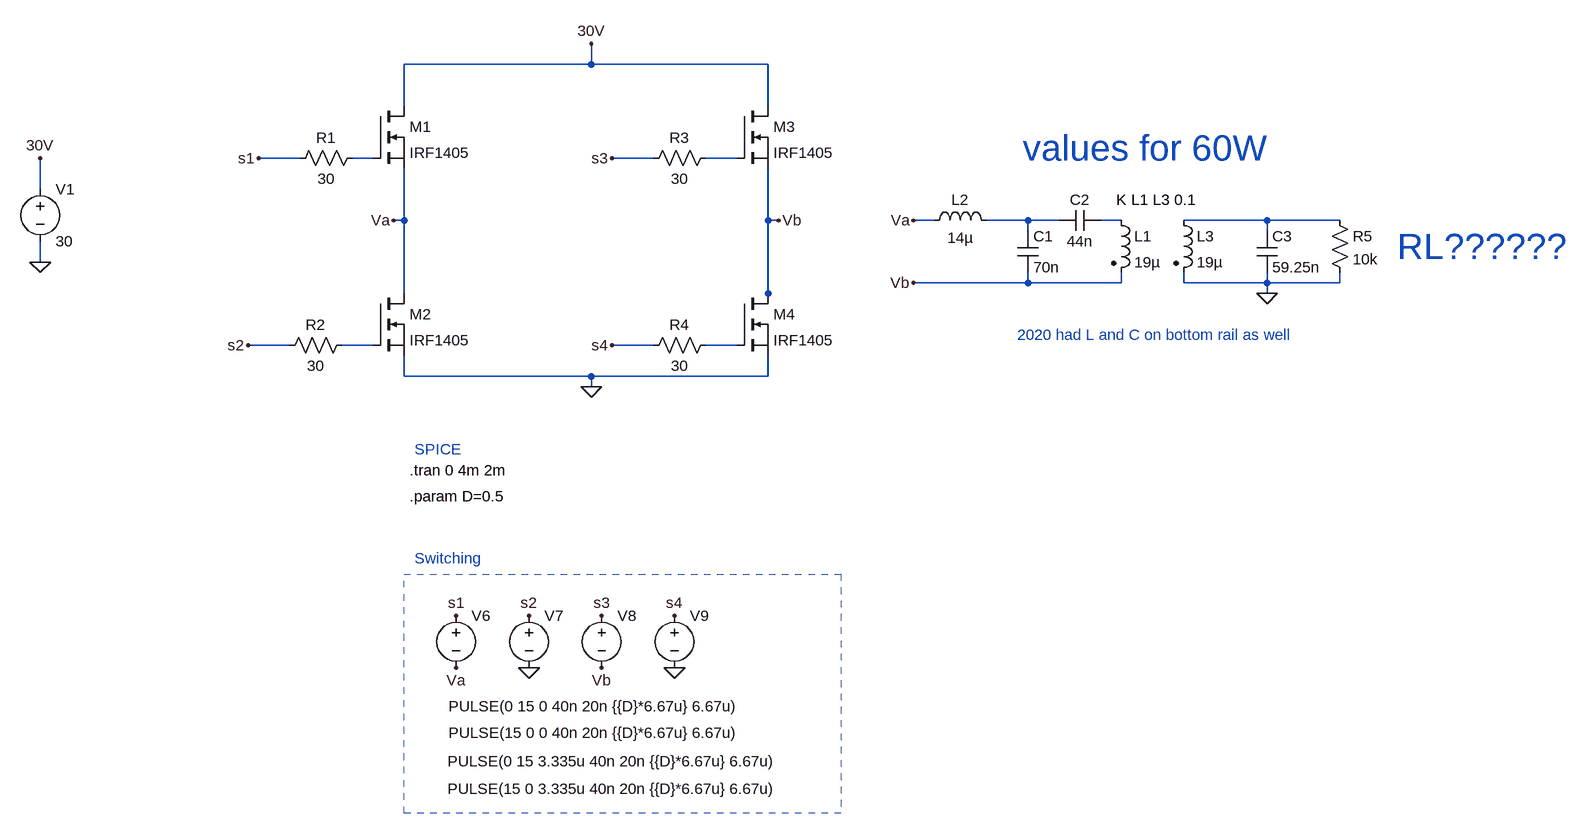
[diagram p0: schematic primary_system.asc]
primary_system.asc, the LTspice schematic file:
Version 4
SHEET 1 2000 1092
WIRE 352 -64 352 -96
WIRE 352 -64 64 -64
WIRE 624 -64 352 -64
WIRE 64 0 64 -64
WIRE 624 0 624 -64
WIRE -96 80 -160 80
WIRE 16 80 -16 80
WIRE 448 80 384 80
WIRE 576 80 528 80
WIRE -496 128 -496 80
WIRE 64 176 64 96
WIRE 64 176 48 176
WIRE 624 176 624 96
WIRE 640 176 624 176
WIRE 880 176 848 176
WIRE 1024 176 960 176
WIRE 1072 176 1024 176
WIRE 1168 176 1136 176
WIRE 1392 176 1264 176
WIRE 1504 176 1392 176
WIRE 1024 192 1024 176
WIRE 1392 192 1392 176
WIRE -496 240 -496 208
WIRE 1024 272 1024 256
WIRE 1024 272 848 272
WIRE 1168 272 1168 256
WIRE 1168 272 1024 272
WIRE 1264 272 1264 256
WIRE 1392 272 1392 256
WIRE 1392 272 1264 272
WIRE 1504 272 1504 256
WIRE 1504 272 1392 272
WIRE 64 288 64 176
WIRE 624 288 624 176
WIRE 1392 288 1392 272
WIRE 624 304 624 288
WIRE -112 368 -176 368
WIRE 16 368 -32 368
WIRE 448 368 384 368
WIRE 576 368 528 368
WIRE 64 416 64 384
WIRE 352 416 64 416
WIRE 624 416 624 384
WIRE 624 416 352 416
WIRE 352 432 352 416
FLAG 48 176 Va
FLAG 640 176 Vb
FLAG 144 864 Va
FLAG 368 864 Vb
FLAG 256 864 0
FLAG 480 864 0
FLAG 144 784 s1
FLAG 256 784 s2
FLAG 368 784 s3
FLAG 480 784 s4
FLAG -160 80 s1
FLAG -176 368 s2
FLAG 384 80 s3
FLAG 384 368 s4
FLAG 352 432 0
FLAG 848 176 Va
FLAG 848 272 Vb
FLAG 1392 288 0
FLAG -496 240 0
FLAG -496 80 30V
FLAG 352 -96 30V
SYMBOL nmos 16 0 R0
SYMATTR InstName M1
SYMATTR Value IRF1405
SYMBOL res 0 64 R90
WINDOW 0 0 56 VBottom 2
WINDOW 3 32 56 VTop 2
SYMATTR InstName R1
SYMATTR Value 30
SYMBOL res -16 352 R90
WINDOW 0 0 56 VBottom 2
WINDOW 3 32 56 VTop 2
SYMATTR InstName R2
SYMATTR Value 30
SYMBOL res 544 64 R90
WINDOW 0 0 56 VBottom 2
WINDOW 3 32 56 VTop 2
SYMATTR InstName R3
SYMATTR Value 30
SYMBOL res 432 384 R270
WINDOW 0 32 56 VTop 2
WINDOW 3 0 56 VBottom 2
SYMATTR InstName R4
SYMATTR Value 30
SYMBOL nmos 16 288 R0
SYMATTR InstName M2
SYMATTR Value IRF1405
SYMBOL nmos 576 0 R0
SYMATTR InstName M3
SYMATTR Value IRF1405
SYMBOL nmos 576 288 R0
SYMATTR InstName M4
SYMATTR Value IRF1405
SYMBOL ind2 1152 160 R0
SYMATTR InstName L1
SYMATTR Value 19µ
SYMATTR Type ind
SYMBOL cap 1008 192 R0
SYMATTR InstName C1
SYMATTR Value 70n
SYMBOL cap 1136 160 R90
WINDOW 0 0 32 VBottom 2
WINDOW 3 32 32 VTop 2
SYMATTR InstName C2
SYMATTR Value 44n
SYMBOL ind2 1248 160 R0
SYMATTR InstName L3
SYMATTR Value 19µ
SYMATTR Type ind
SYMBOL ind 864 192 R270
WINDOW 0 32 56 VTop 2
WINDOW 3 5 56 VBottom 2
SYMATTR InstName L2
SYMATTR Value 14µ
SYMATTR SpiceLine Rser=50
SYMBOL cap 1376 192 R0
SYMATTR InstName C3
SYMATTR Value 59.25n
SYMBOL voltage 144 768 R0
WINDOW 3 -12 155 Left 2
WINDOW 123 0 0 Left 0
WINDOW 39 0 0 Left 0
SYMATTR Value PULSE(0 15 0 40n 20n {{D}*6.67u} 6.67u)
SYMATTR InstName V6
SYMBOL voltage 256 768 R0
WINDOW 3 -124 196 Left 2
WINDOW 123 0 0 Left 0
WINDOW 39 0 0 Left 0
SYMATTR Value PULSE(15 0 0 40n 20n {{D}*6.67u} 6.67u)
SYMATTR InstName V7
SYMBOL voltage 368 768 R0
WINDOW 3 -237 240 Left 2
WINDOW 123 0 0 Left 0
WINDOW 39 0 0 Left 0
SYMATTR Value PULSE(0 15 3.335u 40n 20n {{D}*6.67u} 6.67u)
SYMATTR InstName V8
SYMBOL voltage 480 768 R0
WINDOW 3 -349 282 Left 2
WINDOW 123 0 0 Left 0
WINDOW 39 0 0 Left 0
SYMATTR Value PULSE(15 0 3.335u 40n 20n {{D}*6.67u} 6.67u)
SYMATTR InstName V9
SYMBOL res 1488 160 R0
SYMATTR InstName R5
SYMATTR Value 10k
SYMBOL voltage -496 112 R0
WINDOW 123 0 0 Left 0
WINDOW 39 0 0 Left 0
SYMATTR InstName V1
SYMATTR Value 30
TEXT 1160 144 Left 2 !K L1 L3 0.1
TEXT 1016 64 Left 5 ;values for 60W
TEXT 72 600 Left 2 !.param D=0.5
TEXT 72 560 Left 2 !.tran 0 4m 2m
TEXT 1592 216 Left 5 ;RL??????
TEXT 1008 352 Left 2 ;2020 had L and C on bottom rail as well
TEXT 80 696 Left 2 ;Switching
TEXT 80 528 Left 2 ;SPICE
RECTANGLE Normal 736 1088 64 720 2

The netlist it stands for:
* primary_system.asc
M1 30V N001 Va Va IRF1405
R1 N001 s1 30
R2 N006 s2 30
R3 N002 s3 30
R4 s4 N007 30
M2 Va N006 0 0 IRF1405
M3 30V N002 Vb Vb IRF1405
M4 Vb N007 0 0 IRF1405
L1 N004 Vb 19µ
C1 N003 Vb 70n
C2 N004 N003 44n
L3 N005 0 19µ
L2 Va N003 14µ Rser=50
C3 N005 0 59.25n
V6 s1 Va PULSE(0 15 0 40n 20n {{D}*6.67u} 6.67u)
V7 s2 0 PULSE(15 0 0 40n 20n {{D}*6.67u} 6.67u)
V8 s3 Vb PULSE(0 15 3.335u 40n 20n {{D}*6.67u} 6.67u)
V9 s4 0 PULSE(15 0 3.335u 40n 20n {{D}*6.67u} 6.67u)
R5 N005 0 10k
V1 30V 0 30
.model NMOS NMOS
.model PMOS PMOS
.lib standard.mos
K L1 L3 0.1
* values for 60W
.param D=0.5
.tran 0 4m 2m
* RL??????
* 2020 had L and C on bottom rail as well
* Switching
* SPICE
.backanno
.end